# EAGLE design Mini_Oval (EAGLE 6.5.0)
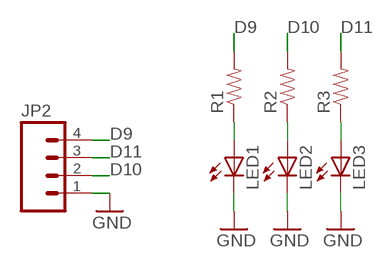
[diagram p0: schematic, sheet 1]

## Parts
JP2  M04PTH  [1X04]
LED1  LEDOVAL  [LED-OVAL]
LED2  LEDOVAL  [LED-OVAL]
LED3  LEDOVAL  [LED-OVAL]
R1  RESISTORAXIAL-0.3  [AXIAL-0.3]
R2  RESISTORAXIAL-0.3  [AXIAL-0.3]
R3  RESISTORAXIAL-0.3  [AXIAL-0.3]

## Nets
D9: JP2.4 R1.P$2
D10: JP2.2 R2.P$2
D11: JP2.3 R3.P$2
GND: JP2.1 LED1.CATHODE(C) LED2.CATHODE(C) LED3.CATHODE(C)
N$1: LED1.ANODE(A) R1.P$1
N$3: LED2.ANODE(A) R2.P$1
N$5: LED3.ANODE(A) R3.P$1

## Library data of the parts
JP2 = SparkFun-Connectors:M04: Header 4 Standard 4-pin 0.1" header. Use with straight break away headers (SKU : PRT-00116), right angle break away headers (PRT-00553), swiss pins (PRT-00743), machine pins (PRT-00117), and female headers (PRT-00115). Molex polarized connector foot print use with SKU : PRT-08231 with associated crimp pins and housings. 1MM SMD Version SKU: PRT-10208
LED1-LED3 = barbary_enterprises:LED: LEDs Standard schematic elements and footprints for 5mm, 3mm, 1206, and 0603 sized LEDs. 5mm - Spark Fun Electronics SKU : COM-00529 (and others)
R1-R3 = barbary_enterprises:RESISTOR: Resistor Basic schematic elements and footprints for 0603, 1206, and PTH resistors.

## Board
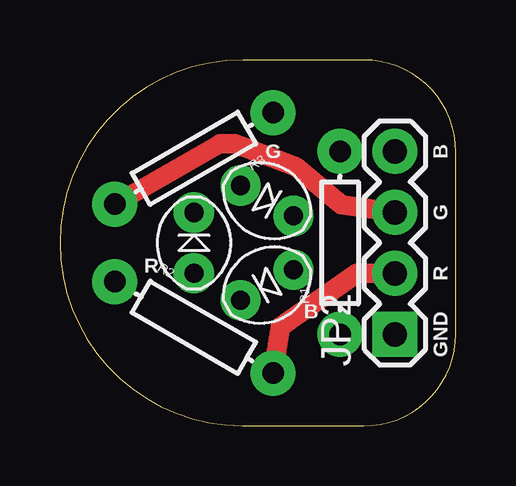
[diagram p1: board, top side]
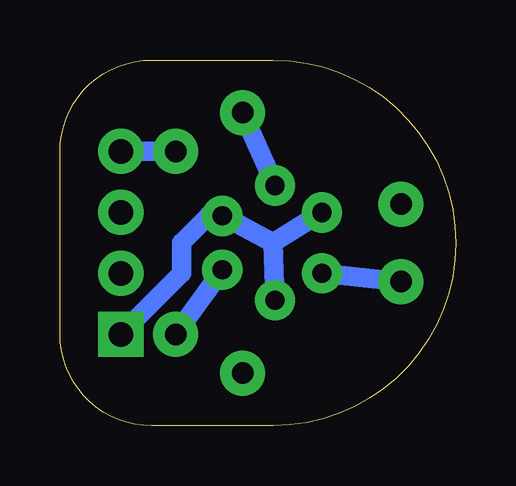
[diagram p2: board, bottom side, seen from below]

Size 16.51 x 15.24 mm. Coordinates in mm from the lower left corner, seen from the top.
Outline: 7.61,0 12.69,0 arc90 16.51,3.82 16.51,11.42 arc90 12.69,15.24 7.63,15.24 arc90 0,7.61 arc90 7.61,0
Copper layers (1*16): Top 0.0356mm / dielectric 1.5011mm / Bottom 0.0356mm
Design rules "LaenPCBOrder": minimum track width 6mil, minimum drill 13mil, track to track 6mil, track to pad 6mil, pad to pad 6mil, via to via 6mil, smd to smd 6mil, copper to edge 15mil, drill to drill 6mil, minimum pad ring 7mil, minimum via ring 7mil, stop-mask expansion 3mil, vias tented up to drill 0mil, thermal gap 10mil

### Footprints (pad centres in the part's own frame; a part is rotated, then mirrored left to right if it is on the bottom)
1X04 = drill 1.016 pad 1.88 square: 1 0,0 | drill 1.016 pad 1.88: 2 2.54,0; 3 5.08,0; 4 7.62,0
LED-OVAL = drill 0.8 pad 1.676: ANODE 1.27,0; CATHODE -1.27,0
AXIAL-0.3 = drill 0.9 pad 1.88: P$1 -3.81,0; P$2 3.81,0

### Placement (x,y rotation side)
JP2  13.97,3.81 90 top
LED1  8.64,5.86 30 top
LED2  5.59,7.62 270 top
LED3  8.64,9.38 150 top
R1  11.68,7.62 90 top
R2  5.59,4.1 330 top
R3  5.59,11.14 210 top

### Tracks (layer width: path | path; a pad name or v marks a point on that pad's centre or on a via)
D9
  Bottom 0.813: JP2.4 R1.P$2
D10
  Top 0.813: R2.P$2 9.21,4.13 12.38,6.35 JP2.2
D11
  Top 0.813: JP2.3 11.75,9.21 9.84,10.79 7.3,11.75 6.67,11.75 R3.P$2
GND
  Bottom 0.813: LED2.CATHODE 7.62,7.62 | 7.62,7.62 LED1.CATHODE | 7.62,7.62 LED3.CATHODE 10.3,8.74 11.43,7.62 11.43,6.35 JP2.1
N$1
  Bottom 0.813: R1.P$1 LED1.ANODE
N$3
  Bottom 0.813: R2.P$1 LED2.ANODE
N$5
  Bottom 0.813: LED3.ANODE R3.P$1

### Text on the board
tPlace: G | B | G | R | R | B | GND